# EAGLE design 3w-rgb-led-connector-mk-1.0 (EAGLE 6.5.0)
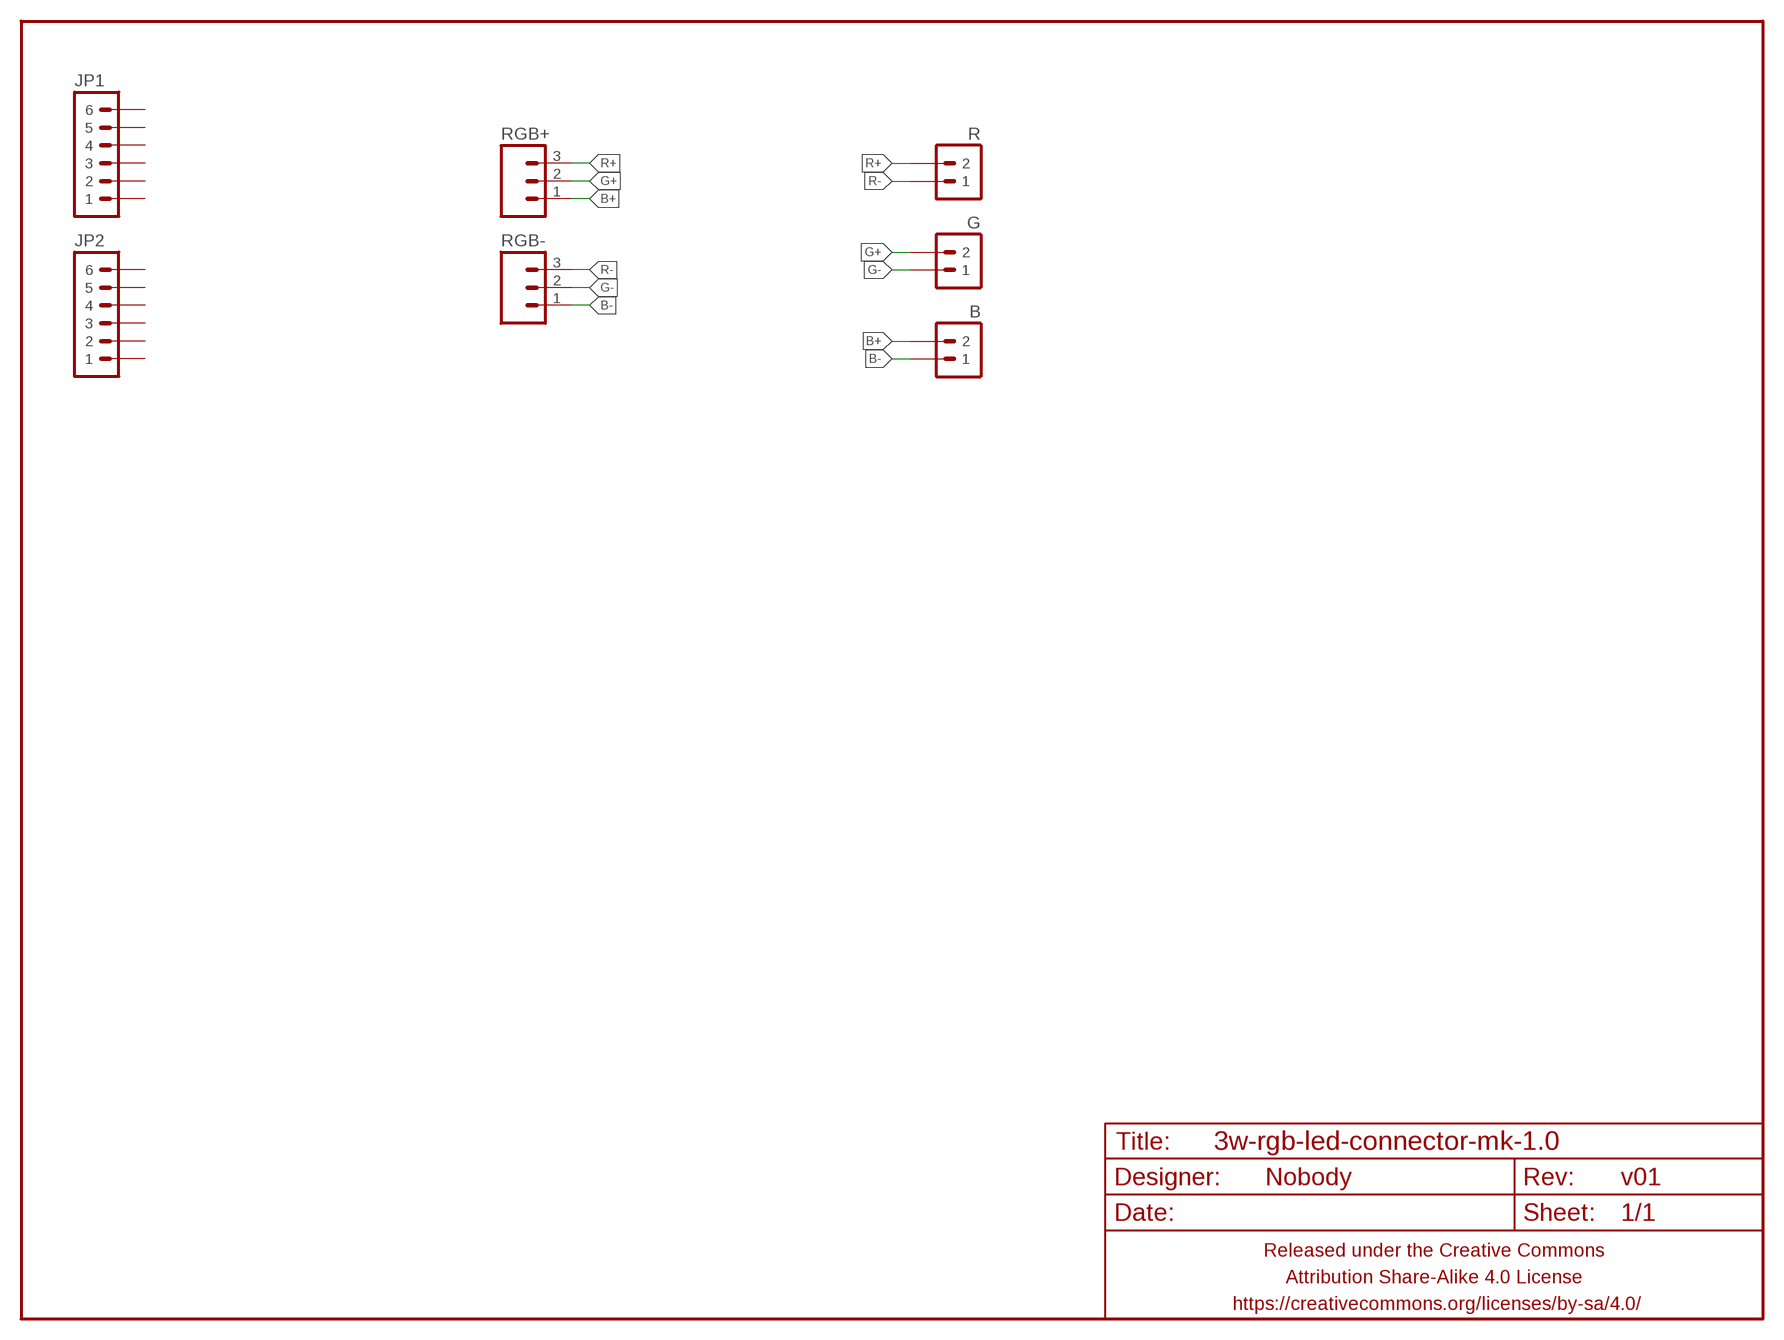
[diagram p0: schematic, sheet 1]

## Parts
B  M023.5MM-NO_SILK  [SCREWTERMINAL-3.5MM-2-NS]
FRAME1  FRAME-LETTERNO_PACKAGE  [DUMMY]
G  M023.5MM-NO_SILK  [SCREWTERMINAL-3.5MM-2-NS]
JP1  M06SIP  [1X06]
JP2  M06SIP  [1X06]
R  M023.5MM-NO_SILK  [SCREWTERMINAL-3.5MM-2-NS]
RGB+  M03JST-XH-RA-PTH  [JST-3-XH-RA-PTH]
RGB-  M03JST-XH-RA-PTH  [JST-3-XH-RA-PTH]

## Nets
B+: B.2 RGB+.1
B-: B.1 RGB-.1
G+: G.2 RGB+.2
G-: G.1 RGB-.2
R+: R.2 RGB+.3
R-: R.1 RGB-.3
Unconnected: JP1.1 JP1.2 JP1.3 JP1.4 JP1.5 JP1.6 JP2.1 JP2.2 JP2.3 JP2.4 JP2.5 JP2.6

## Library data of the parts
B G R = A_butts:M02: Standard 2-pin 0.1" header. Use with - straight break away headers ( PRT-00116) - right angle break away headers (PRT-00553) - swiss pins (PRT-00743) - machine pins (PRT-00117) - female headers (PRT-00115) Molex polarized connector foot print use with: PRT-08233 with associated crimp pins and housings. 2.54_SCREWTERM for use with PRT-10571. 3.5mm Screw Terminal footprints for PRT-08084 5mm Screw Terminal footprints for use with PRT-08433
FRAME1 = A_butts:FRAME-LETTER: Schematic Frame Standard 8.5x11 US Letter frame; DESIGNER: Nobody; VERSION: v01
JP1 JP2 = A_butts:M06: Header 6 Standard 6-pin 0.1" header. Use with straight break away headers (SKU : PRT-00116), right angle break away headers (PRT-00553), swiss pins (PRT-00743), machine pins (PRT-00117), and female headers (PRT-00115). Molex polarized connector foot print use with SKU : PRT-08094 with associated crimp pins and housings. NOTES ON THE VARIANTS LOCK and LOCK_LONGPADS... This footprint was designed to help hold the alignment of a through-hole component (i.e. 6-pin header) while soldering it into place. You may notice that each hole has been shifted either up or down by 0.005 of an inch from it's more standard position (which is a perfectly straight line). This slight alteration caused the pins (the squares in the middle) to touch the edges of the holes. Because they are alternating, it causes a "brace" to hold the component in place. 0.005 has proven to be the perfect amount of "off-center" position when using our standard breakaway headers. Although looks a little odd when you look at the bare footprint, once you have a header in there, the alteration is very hard to notice. Also,if you push a header all the way into place, it is covered up entirely on the bottom side. This idea of altering the position of holes to aid alignment will be further integrated into the Sparkfun Library for other footprints. It can help hold any component with 3 or more connection pins.
RGB+ RGB- = A_butts:M03: Header 3 Standard 3-pin 0.1" header. Use with straight break away headers (SKU : PRT-00116), right angle break away headers (PRT-00553), swiss pins (PRT-00743), machine pins (PRT-00117), and female headers (PRT-00115). Molex polarized connector foot print use with SKU : PRT-08232 with associated crimp pins and housings.

## Board
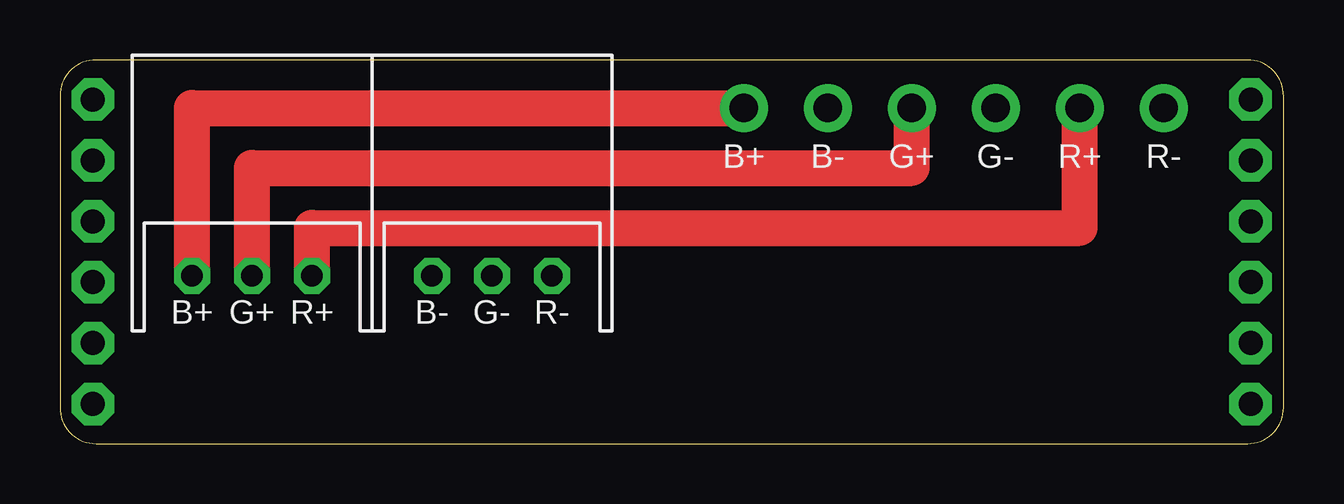
[diagram p1: board, top side]
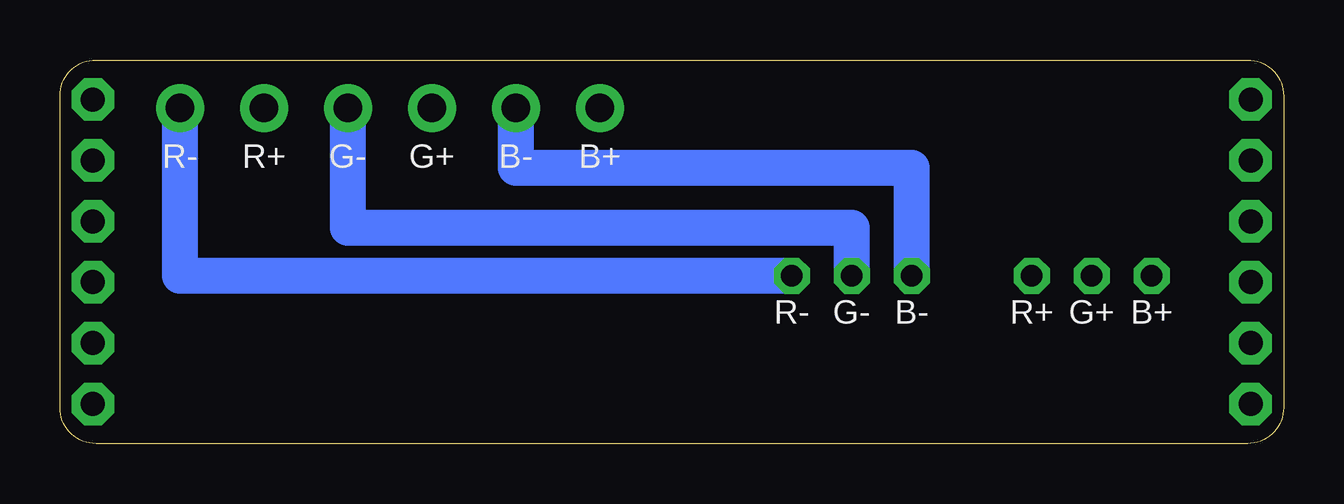
[diagram p2: board, bottom side, seen from below]

Size 51 x 16 mm. Coordinates in mm from the lower left corner, seen from the top.
Outline: 0,14.5 0,1.5 arc90 1.5,0 49.5,0 arc90 51,1.5 51,14.5 arc90 49.5,16 1.5,16 arc90 0,14.5
Copper layers (1*16): Top 0.0356mm / dielectric 1.5011mm / Bottom 0.0356mm
Design rules "LaenPCBOrder_2": minimum track width 6mil, minimum drill 13mil, track to track 6mil, track to pad 6mil, pad to pad 6mil, via to via 6mil, smd to smd 6mil, copper to edge 15mil, drill to drill 6mil, minimum pad ring 7mil, minimum via ring 7mil, stop-mask expansion 3mil, vias tented up to drill 20mil, thermal gap 10mil

### Footprints (pad centres in the part's own frame; a part is rotated, then mirrored left to right if it is on the bottom)
SCREWTERMINAL-3.5MM-2-NS = drill 1.2 pad 2: 1 0,0; 2 3.5,0
1X06 = drill 1 pad 1.778 octagon: 1 0,0; 2 2.54,0; 3 5.08,0; 4 7.62,0; 5 10.16,0; 6 12.7,0
JST-3-XH-RA-PTH = drill 0.9 pad 1.5 octagon: 1 -2.5,0; 2 0,0; 3 2.5,0

### Placement (x,y rotation side)
B  32,14 180 top
FRAME1  0,0 0 top
G  39,14 180 top
JP1  1.37,1.65 90 top
JP2  49.63,1.65 90 top
R  46,14 180 top
RGB+  8,7 0 top
RGB-  18,7 0 top

### Tracks (layer width: path | path; a pad name or v marks a point on that pad's centre or on a via)
B+
  Top 1.5: RGB+.1 5.5,14 B.2
B-
  Bottom 1.5: RGB-.1 15.5,11.5 32,11.5 B.1
G+
  Top 1.5: RGB+.2 8,11.5 35.5,11.5 G.2
G-
  Bottom 1.5: RGB-.2 18,9 39,9 G.1
R+
  Top 1.5: RGB+.3 10.5,9 42.5,9 R.2
R-
  Bottom 1.5: RGB-.3 46,7 R.1

### Text on the board
tPlace: B+ | B- | G+ | G- | R+ | R- | B+ | G+ | R+ | B- | G- | R-
bPlace: B+ | B- | G+ | G- | R+ | R- | B+ | G+ | R+ | B- | G- | R-